# Altium project Assignment_2.PrjPcb
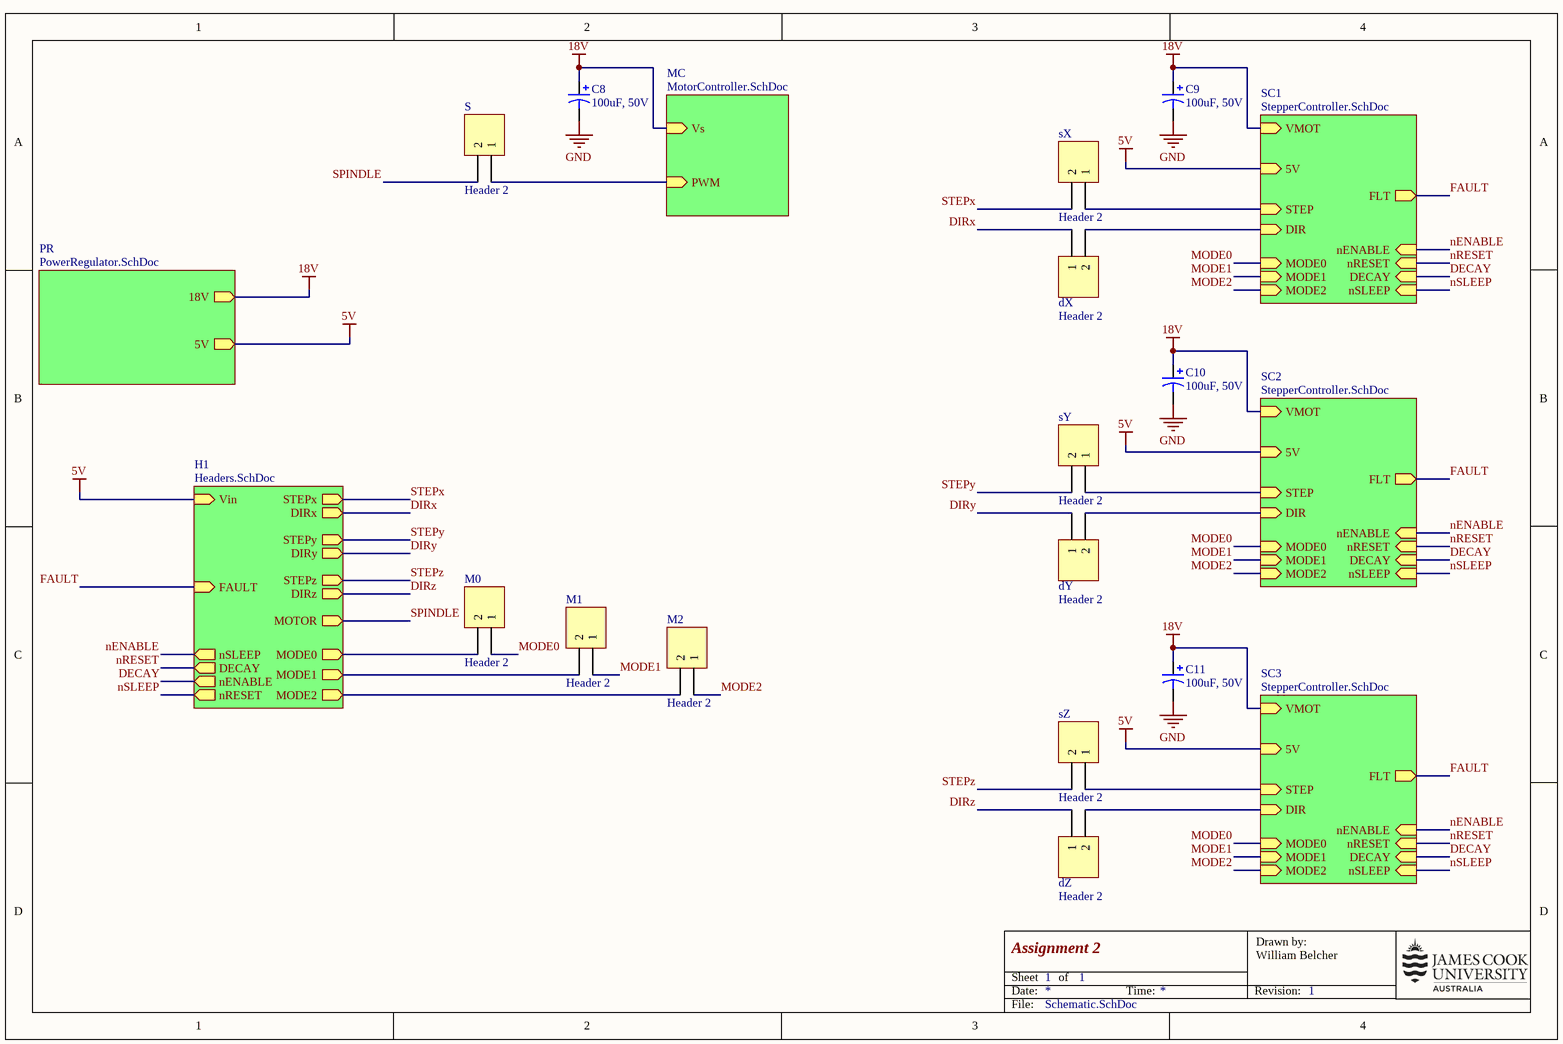
[diagram p0: Schematic.SchDoc]
5 sheets, 66 parts. Net scope: hierarchical (ports join the sheet entries above them; power ports are global).
Board file: PCB.PcbDoc
Sheets:
  Schematic.SchDoc
    PR = PowerRegulator.SchDoc
    SC1 = StepperController.SchDoc
    H1 = Headers.SchDoc
    MC = MotorController.SchDoc
    SC2 = StepperController.SchDoc
    SC3 = StepperController.SchDoc

## Sheet Schematic.SchDoc: Assignment 2
size A4; DrawnBy: William Belcher; Revision: 1; SheetNumber: 1; SheetTotal: 1

### Parts
C8  100uF, 50V  [Capacitor radial 8mm]
C9  100uF, 50V  [Capacitor radial 8mm]
C10  100uF, 50V  [Capacitor radial 8mm]
C11  100uF, 50V  [Capacitor radial 8mm]
dX  Header 2  [HDR1X2]
dY  Header 2  [HDR1X2]
dZ  Header 2  [HDR1X2]
M0  Header 2  [HDR1X2]
M1  Header 2  [HDR1X2]
M2  Header 2  [HDR1X2]
S  Header 2  [HDR1X2]
sX  Header 2  [HDR1X2]
sY  Header 2  [HDR1X2]
sZ  Header 2  [HDR1X2]

### Sub-sheets
H1 = Headers.SchDoc: STEPx (out), DIRx (out), DIRy (out), STEPy (out), STEPz (out), DIRz (out), MOTOR (out), MODE1 (out), MODE2 (out), MODE0 (out), FAULT (in), Vin (in), nSLEEP (out), DECAY (out), nENABLE (out), nRESET (out)
MC = MotorController.SchDoc: PWM (in), Vs (in)
PR = PowerRegulator.SchDoc: 18V (out), 5V (out)
SC1 = StepperController.SchDoc: DIR (in), STEP (in), VMOT (in), 5V (in), FLT (out), MODE0 (in), MODE1 (in), MODE2 (in), nENABLE (in), nRESET (in), DECAY (in), nSLEEP (in)
SC2 = StepperController.SchDoc: DIR (in), STEP (in), VMOT (in), 5V (in), FLT (out), MODE0 (in), MODE1 (in), MODE2 (in), nENABLE (in), nRESET (in), DECAY (in), nSLEEP (in)
SC3 = StepperController.SchDoc: DIR (in), STEP (in), VMOT (in), 5V (in), FLT (out), MODE0 (in), MODE1 (in), MODE2 (in), nENABLE (in), nRESET (in), DECAY (in), nSLEEP (in)

### Nets
5V: sheet PR/5V, sheet SC1/5V, sheet H1/Vin, sheet SC2/5V, sheet SC3/5V
18V: C8.1 C9.1 C10.1 C11.1 ; sheet PR/18V, sheet SC1/VMOT, sheet MC/Vs, sheet SC2/VMOT, sheet SC3/VMOT
GND: C8.2 C9.2 C10.2 C11.2
DECAY: sheet SC1/DECAY, sheet H1/nENABLE, sheet SC2/DECAY, sheet SC3/DECAY
DIRx: dX.1 ; sheet H1/DIRx
DIRy: dY.1 ; sheet H1/DIRy
DIRz: dZ.1 ; sheet H1/DIRz
FAULT: sheet SC1/FLT, sheet H1/FAULT, sheet SC2/FLT, sheet SC3/FLT
MODE0: M0.1 ; sheet SC1/MODE0, sheet SC2/MODE0, sheet SC3/MODE0
MODE1: M1.1 ; sheet SC1/MODE1, sheet SC2/MODE1, sheet SC3/MODE1
MODE2: M2.1 ; sheet SC1/MODE2, sheet SC2/MODE2, sheet SC3/MODE2
nENABLE: sheet SC1/nENABLE, sheet H1/nSLEEP, sheet SC2/nENABLE, sheet SC3/nENABLE
nRESET: sheet SC1/nRESET, sheet H1/DECAY, sheet SC2/nRESET, sheet SC3/nRESET
nSLEEP: sheet SC1/nSLEEP, sheet H1/nRESET, sheet SC2/nSLEEP, sheet SC3/nSLEEP
SPINDLE: S.2 ; sheet H1/MOTOR
STEPx: sX.2 ; sheet H1/STEPx
STEPy: sY.2 ; sheet H1/STEPy
STEPz: sZ.2 ; sheet H1/STEPz
Net*_J1_7: M2.2 ; sheet H1/MODE2
Net*_J1_9: M1.2 ; sheet H1/MODE1
Net*_J1_11: M0.2 ; sheet H1/MODE0
NetdX_2: dX.2 ; sheet SC1/DIR
NetdY_2: dY.2 ; sheet SC2/DIR
NetdZ_2: dZ.2 ; sheet SC3/DIR
NetQ1x_22: sX.1 ; sheet SC1/STEP
NetQ1y_22: sY.1 ; sheet SC2/STEP
NetQ1z_22: sZ.1 ; sheet SC3/STEP
NetR1_1: S.1 ; sheet MC/PWM

### Notes on the sheet
- Date:
- Sheet
- of
- Time:
- Revision:
- Drawn by:
- File:

### Library data of the parts
C8-C11 = Cap 100uF, 50V, THT radial: Electrolytic Capacitor, 100 µF, 50 V, ± 20%, Radial Leaded, 8 mm
dX dY dZ M0-M2 S sX sY sZ = Header 2: Header, 2-Pin; LatestRevisionDate: 17-Jul-2002; LatestRevisionNote: Re-released for DXP Platform.; Publisher: Altium Limited

## Sheet PowerRegulator.SchDoc
size A4
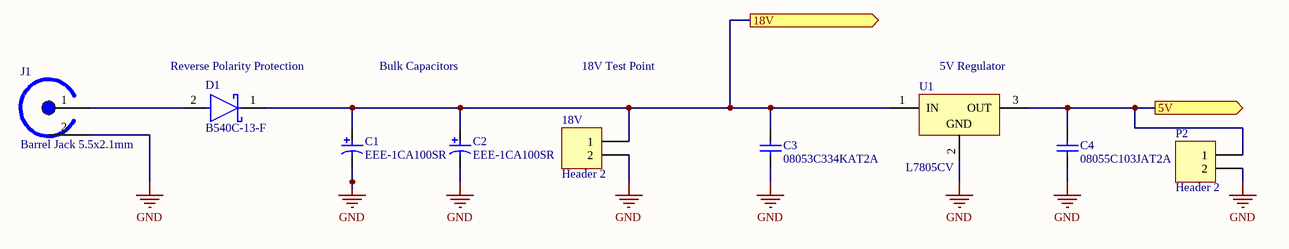
[diagram p1: PowerRegulator.SchDoc]

### Parts
(Parts that share a designator on the sheet are numbered #1, #2 ... from top to bottom, then left to right.)
18V  Header 2  [HDR1X2]
C1#1  EEE-1CA100SR  [PNSC-EEE1CA100SR_L]
C2  EEE-1CA100SR  [PNSC-EEE1CA100SR_L]
C3  08053C334KAT2A  [CAPC2013X140X50NL20T25]
C4  08055C103JAT2A  [CAPC2013X94X50ML20T25]
D1#1  B540C-13-F  [FP-SMC-MFG]
J1  Barrel Jack 5.5x2.1mm  [Barrel Jack 2.1x5.5mm THT]
P2  Header 2  [HDR1X2]
U1  L7805CV  [TO220]

### Ports
5V (out), 18V (out)

### Nets
5V: C4.2 P2.1 U1.3(OUT) ; port 5V
18V: 18V.1 C1#1.1 C2.1 C3.1 D1#1.1(C) U1.1(IN) ; port 18V
GND: 18V.2 C1#1.2 C2.2 C3.2 C4.1 J1.2(SLEEVE) P2.2 U1.2(GND)
NetD1#1_2: D1#1.2(A) J1.1(TIP)

### Notes on the sheet
- (near D1#1) Reverse Polarity Protection
- Bulk Capacitors
- 18V Test Point
- (near U1) 5V Regulator

### Library data of the parts
18V P2 = Header 2: Header, 2-Pin; LatestRevisionDate: 17-Jul-2002; LatestRevisionNote: Re-released for DXP Platform.; Publisher: Altium Limited
C1#1 C2 = CMP-2000-06199-1: Aluminum Electrolytic Capacitor, 10 uF, +/- 20%, -40 to 85 degC, 2-Pin SMD, RoHS, Tape and Reel; Manufacturer: Panasonic; Lead Length: 1.8mm; No. of Pins: 2; Ripple Current Frequency: 120Hz; Ripple Current Temperature: 85°C; External Depth: 4.3mm; Operating Lifetime: 2000h; Power Factor: 0.16; Lead Cross-section Width: 0.65mm; Product Range: PANASONIC-SSeries; Voltage Rating V DC: 16V; Leakage Current: 3µA; Ripple Current AC: 28mA; AE Capacitor Case: RadialCan-SMD; Capacitance: 10µF; Lifetime @ Temperature: 2000hours@85°C; External Length / Height: 5.4mm; SVHC: NoSVHC(16-Dec-2013); Packaging: CutTape; Series: VS; Package Description: 2-Pin Surface Mount Device, Body 4.5 x 4.5 mm; Tolerance -: 20%; Capacitor Terminals: SMD; Lead Spacing: 1mm; Package / Case: B; Capacitance Tolerance: ±20%; Operating life Time: 2000h; Tape Width: 12mm; Power Factor Frequency: 120Hz; Voltage Rating: 16V; Diameter: 4mm; Operating Temperature Max: 85°C; Datasheet URL: https://datasheet.ciiva.com/19458/1355487-19458346.pdf; Capacitor Mounting: SMD; External Width: 4.3mm; Operating Life Temperature: 85°C; Capacitance Tolerance ±: ±20%; Package Reference: EEE1CA100SR; AC Ripple Current: 28mA; Tolerance +: 20%; Height: 5.4mm; Datasheet Version: 04/2005; Operating Temperature Min: -40°C; Capacitor Case Style: RadialCan-SMD; Mounting Technology: SurfaceMount; Operating Temperature Range: -40°Cto+85°C; Manufacturer URL: http://www.panasonic.com/; Life Time @ Temperature: 2000hours@85°C
C3 = CMP-2007-04608-1: Manufacturer: AVX Interconnect / Elco; Part Number: 08053C334KAT2A
C4 = CMP-2007-04361-1: Manufacturer: AVX Interconnect / Elco; Part Number: 08055C103JAT2A
D1#1 = CMP-12790-000056-1: DIODE SCHOTTKY 40V 5A SMC; Manufacturer: Diodes Inc.; Automotive Grade: NA; Peak Reverse Current: 0.5mA; Value: 300pF; Max Junction Temp: +150°C; Max Surge Forward Current: 100A; Standoff Height: 0.1mm; Digikey Description: DIODE SCHOTTKY 40V 5A SMC; Temperature Range Low: -55°C; Manufacturer Part Number: B540C-13-F; Octopart: https://octopart.com/b540c-13-f-diodes+inc.-325873; Lead Free: Yes; Reverse Voltage: 40V; RoHS: TRUE; Category: Diode; Mouser Description: Diode: Schottky rectifying; SMD; 40V; 5A; SMC; Package: reel, tape; ComponentLink2Description: Datasheet; Temperature Range High: +150°C; Automotive: No; Footprint Url: https://www.diodes.com/assets/Package-Files/SMC.pdf; Device Class L3: Schottky Diodes; Height: 2.5mm; Forward Current: 5A; Temperature: -55°C to +150°C; Package: SMC; ComponentLink2URL: https://www.diodes.com/assets/Datasheets/ds13012.pdf; Device Class L2: Diodes; Max Repetitive Reverse Voltage: 40V; Device Class L1: Discrete Semiconductors; Capacitance: 300pF
J1 = Barrel Jack 5.5x2.1mm: GCT DCJ200-10-A-K1-K
U1 = CMP-0244-00483-1: Positive Voltage Regulator, 5V, 3-Pin TO-220; PackageDescription: TO, Thru-Hole, Vertical, Heatsink Mounted; 3 In-Line Leads; Pitch 2.54 mm; ComponentLink2Description: Datasheet; PackageReference: TO220; ComponentLink3URL: http://www.st.com/internet/com/TECHNICAL_RESOURCES/TECHNICAL_LITERATURE/PACKAGE_INFORMATION/CD00004649.pdf; DatasheetVersion: 16/11/2011; ComponentLink1Description: Manufacturer URL; ComponentLink1URL: http://www.st.com; PackageVersion: ver3.0; ComponentLink3Description: Package Specification; ComponentLink2URL: http://www.st.com/internet/com/TECHNICAL_RESOURCES/TECHNICAL_LITERATURE/DATASHEET/CD00000444.pdf

## Sheet StepperController.SchDoc
size A4
Used 3 times, as channels SC1, SC2, SC3. Parts and nets are listed once, with the designators drawn on the sheet.
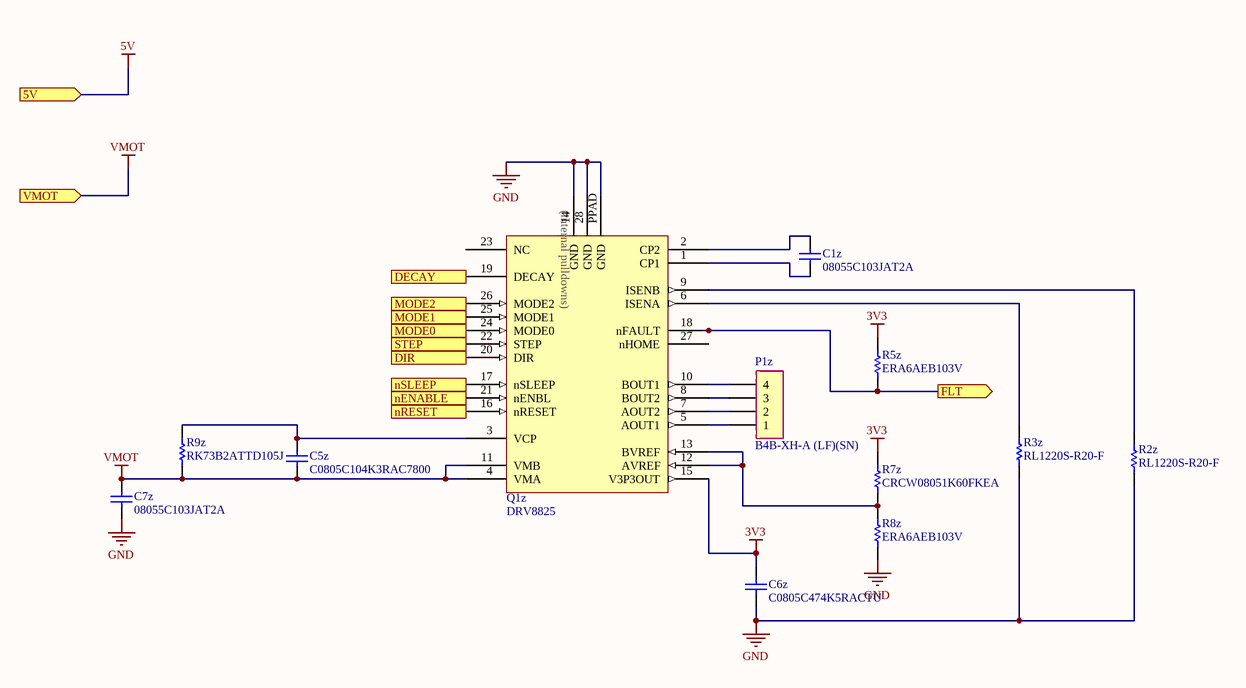
[diagram p2: StepperController.SchDoc]

### Parts
C1z  08055C103JAT2A  [CAPC2013X94X50ML20T25]
C5z  C0805C104K3RAC7800  [CAPC2013X145X50ML20T25]
C6z  C0805C474K5RACTU  [CAPC2013X110X50NL20T25]
C7z  08055C103JAT2A  [CAPC2013X94X50ML20T25]
P1z  B4B-XH-A (LF)(SN)  [B4B-XH-A (LF)(SN)]
Q1z  DRV8825  [DRV8825 HTSSOP]
R2z  RL1220S-R20-F  [RESC2013X50X40ML20T20]
R3z  RL1220S-R20-F  [RESC2013X50X40ML20T20]
R5z  ERA6AEB103V  [RESC2013X60X40ML20T25]
R7z  CRCW08051K60FKEA  [RESC2013X50X30NL20T20]
R8z  ERA6AEB103V  [RESC2013X60X40ML20T25]
R9z  RK73B2ATTD105J  [RESC2013X60X30NL20T20]

### Ports
5V (in), DECAY (in), DIR (in), FLT (out), MODE0 (in), MODE1 (in), MODE2 (in), nENABLE (in), nRESET (in), nSLEEP (in), STEP (in), VMOT (in)

### Nets
3V3: C6z.2 Q1z.15(V3P3OUT) R5z.1 R7z.2
GND: C6z.1 C7z.1 Q1z.14(GND) Q1z.28(GND) Q1z.PPAD(GND) R2z.1 R3z.1 R8z.1
VMOT: C5z.2 C7z.2 Q1z.4(VMA) Q1z.11(VMB) R9z.1 ; port VMOT
DECAY: Q1z.19(DECAY) ; port DECAY
DIR: Q1z.20(DIR) ; port DIR
FLT: Q1z.18(nFAULT) R5z.2 ; port FLT
MODE0: Q1z.24(MODE0) ; port MODE0
MODE1: Q1z.25(MODE1) ; port MODE1
MODE2: Q1z.26(MODE2) ; port MODE2
nENABLE: Q1z.21(nENBL) ; port nENABLE
nRESET: Q1z.16(nRESET) ; port nRESET
nSLEEP: Q1z.17(nSLEEP) ; port nSLEEP
STEP: Q1z.22(STEP) ; port STEP
NetC1z_1: C1z.1 Q1z.1(CP1)
NetC1z_2: C1z.2 Q1z.2(CP2)
NetC5z_1: C5z.1 Q1z.3(VCP) R9z.2
NetP1z_1: P1z.1 Q1z.5(AOUT1)
NetP1z_2: P1z.2 Q1z.7(AOUT2)
NetP1z_3: P1z.3 Q1z.8(BOUT2)
NetP1z_4: P1z.4 Q1z.10(BOUT1)
NetQ1z_6: Q1z.6(ISENA) R3z.2
NetQ1z_9: Q1z.9(ISENB) R2z.2
NetQ1z_12: Q1z.12(AVREF) Q1z.13(BVREF) R7z.1 R8z.2

Not connected (* = marked no-connect by the designer): Q1z 23(NC) 27(nHOME)

### Channels
SC1: designators C1z=C1x C5z=C5x C6z=C6x C7z=C7x P1z=P1x Q1z=Q1x R2z=R2x R3z=R3x R5z=R5x R7z=R7x R8z=R8x R9z=R9x; ports 5V=5V DECAY=DECAY DIR=NetdX_2 FLT=FAULT MODE0=MODE0 MODE1=MODE1 MODE2=MODE2 nENABLE=nENABLE nRESET=nRESET nSLEEP=nSLEEP STEP=NetQ1x_22 VMOT=18V
SC2: designators C1z=C1y C5z=C5y C6z=C6y C7z=C7y P1z=P1y Q1z=Q1y R2z=R2y R3z=R3y R5z=R5y R7z=R7y R8z=R8y R9z=R9y; ports 5V=5V DECAY=DECAY DIR=NetdY_2 FLT=FAULT MODE0=MODE0 MODE1=MODE1 MODE2=MODE2 nENABLE=nENABLE nRESET=nRESET nSLEEP=nSLEEP STEP=NetQ1y_22 VMOT=18V
SC3: ports 5V=5V DECAY=DECAY DIR=NetdZ_2 FLT=FAULT MODE0=MODE0 MODE1=MODE1 MODE2=MODE2 nENABLE=nENABLE nRESET=nRESET nSLEEP=nSLEEP STEP=NetQ1z_22 VMOT=18V

### Notes on the sheet
- Date:
- Sheet
- of
- Time:
- Revision:
- Drawn by:
- File:
- (in symbol Stepper motor driver DRV8825) (internal pulldowns)

### Library data of the parts
C1z C7z = CMP-2007-04361-1: Manufacturer: AVX Interconnect / Elco; Part Number: 08055C103JAT2A
C5z = CMP-2007-01100-1: Manufacturer: Kemet; Part Number: C0805C104K3RAC7800
C6z = CMP-2007-03659-1: Manufacturer: Kemet; Part Number: C0805C474K5RACTU
P1z = B4B-XH-A (LF)(SN) Wire-to-board connector: Wire-to-board connector, vertical, 2.5mm, 4 contacts
Q1z = Stepper motor driver DRV8825: TI DRV8825 Stepper Motor Controller IC
R2z R3z = CMP-2001-03157-1: Manufacturer: Susumu; Part Number: RL1220S-R20-F
R5z R8z = CMP-2001-00582-1: Manufacturer: Panasonic; Part Number: ERA6AEB103V
R7z = CMP-2001-03618-1: Manufacturer: Vishay Dale; Part Number: CRCW08051K60FKEA
R9z = CMP-2001-04658-1: Manufacturer: KOA Speer; Part Number: RK73B2ATTD105J

## Sheet Headers.SchDoc
size A4
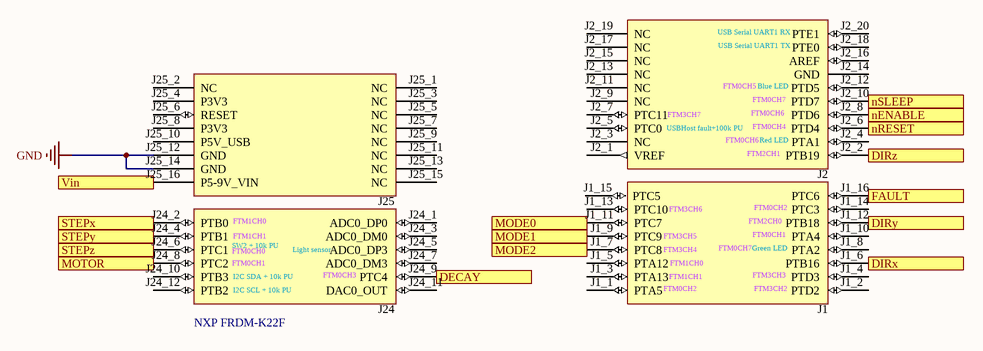
[diagram p3: Headers.SchDoc]

### Parts
*  NXP FRDM-K22F  [FRDM-K22F]

### Ports
DECAY (out), DIRx (out), DIRy (out), DIRz (out), FAULT (in), MODE0 (out), MODE1 (out), MODE2 (out), MOTOR (out), nENABLE (out), nRESET (out), nSLEEP (out), STEPx (out), STEPy (out), STEPz (out), Vin (in)

### Nets
5V: *.J25_16(P5-9V_VIN) ; port Vin
GND: *.J25_12(GND) *.J25_14(GND)
DECAY: *.J2_8(PTD6) ; port nENABLE
DIRx: *.J1_6(PTB16) ; port DIRx
DIRy: *.J1_12(PTB18) ; port DIRy
DIRz: *.J2_2(PTB19) ; port DIRz
FAULT: *.J1_16(PTC6) ; port FAULT
nENABLE: *.J2_10(PTD7) ; port nSLEEP
nRESET: *.J24_9(PTC4) ; port DECAY
nSLEEP: *.J2_6(PTD4) ; port nRESET
SPINDLE: *.J24_8(PTC2) ; port MOTOR
STEPx: *.J24_2(PTB0) ; port STEPx
STEPy: *.J24_4(PTB1) ; port STEPy
STEPz: *.J24_6(PTC1) ; port STEPz
Net*_J1_7: *.J1_7(PTC8) ; port MODE2
Net*_J1_9: *.J1_9(PTC9) ; port MODE1
Net*_J1_11: *.J1_11(PTC7) ; port MODE0

Not connected (* = marked no-connect by the designer): * J1_1(PTA5) J1_2(PTD2) J1_3(PTA13) J1_4(PTD3) J1_5(PTA12) J1_8(PTA2) J1_10(PTA4) J1_13(PTC10) J1_14(PTC3) J1_15(PTC5) J2_1(VREF) J2_3(NC) J2_4(PTA1) J2_5(PTC0) J2_7(PTC11) J2_9(NC) J2_11(NC) J2_12(PTD5) J2_13(NC) J2_14(GND) J2_15(NC) J2_16(AREF) J2_17(NC) J2_18(PTE0) J2_19(NC) J2_20(PTE1) J24_1(ADC0_DP0) J24_3(ADC0_DM0) J24_5(ADC0_DP3) J24_7(ADC0_DM3) J24_10(PTB3) J24_11(DAC0_OUT) J24_12(PTB2) J25_1(NC) J25_2(NC) J25_3(NC) J25_4(P3V3) J25_5(NC) J25_6(RESET) J25_7(NC) J25_8(P3V3) J25_9(NC) J25_10(P5V_USB) J25_11(NC) J25_13(NC) J25_15(NC)

### Notes on the sheet
- Date:
- Sheet
- of
- Time:
- Revision:
- Drawn by:
- File:
- (in symbol NXP FRDM-K22F) USB Serial UART1 RX; USB Serial UART1 TX; FTM0CH5; Blue LED; FTM0CH7; FTM3CH7; FTM0CH6; USBHost fault+100k PU; FTM0CH4; Red LED; FTM2CH1; J2; J25; FTM3CH6; FTM0CH2; FTM1CH0; FTM2CH0; FTM1CH1; FTM3CH5; FTM0CH1; SW2 + 10k PU; FTM0CH0; Light sensor; FTM3CH4; Green LED; I2C SDA + 10k PU; FTM0CH3; FTM3CH3; I2C SCL + 10k PU; FTM3CH2; J24; J1

## Sheet MotorController.SchDoc
size A4
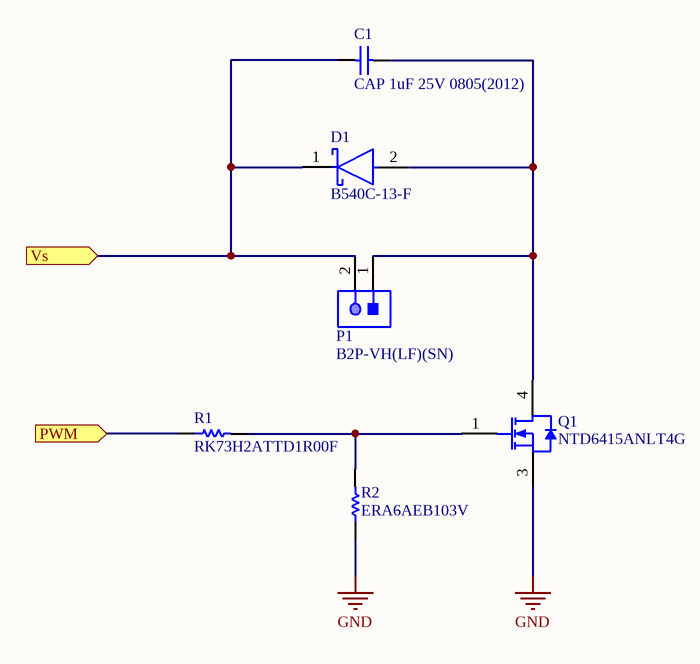
[diagram p4: MotorController.SchDoc]

### Parts
(Parts that share a designator on the sheet are numbered #1, #2 ... from top to bottom, then left to right.)
C1#2  CAP 1uF 25V 0805(2012)  [CAPC0805(2012)145_L]
D1#2  B540C-13-F  [FP-SMC-MFG]
P1  B2P-VH(LF)(SN)  [JST-B2P-VH(LF)(SN)_V]
Q1  NTD6415ANLT4G  [ONSC-DPAK-3-369AA-01_V]
R1  RK73H2ATTD1R00F  [RESC2013X60X30NL20T20]
R2  ERA6AEB103V  [RESC2013X60X40ML20T25]

### Ports
PWM (in), Vs (in)

### Nets
18V: C1#2.1 D1#2.1(C) P1.2 ; port Vs
GND: Q1.3(S) R2.1
NetC1#2_2: C1#2.2 D1#2.2(A) P1.1 Q1.4(D)
NetQ1_1: Q1.1(G) R1.2 R2.2
NetR1_1: R1.1 ; port PWM

### Notes on the sheet
- Date:
- Sheet
- of
- Time:
- Revision:
- Drawn by:
- File:

### Library data of the parts
C1#2 = CMP-1036-04757-1: CAP 1uF 25V -20% to +80% 0805 (2012 Metric) Thickness 1.45mm SMD; Case-Metric: 2012; Case-EIA: 0805; Max Thickness: 1.45 mm; Tolerance: -20% to +80%; Rated Voltage: 25 V; Technology: SMT; Value: 1uF
D1#2 = CMP-12790-000056-1: DIODE SCHOTTKY 40V 5A SMC; Manufacturer: Diodes Inc.; Description: Diode Schottky 40V 5A Surface Mount SMC; Automotive Grade: NA; Peak Reverse Current: 0.5mA; Value: 300pF; Max Junction Temp: +150°C; Max Surge Forward Current: 100A; Standoff Height: 0.1mm; Digikey Description: DIODE SCHOTTKY 40V 5A SMC; Temperature Range Low: -55°C; Manufacturer Part Number: B540C-13-F; Octopart: https://octopart.com/b540c-13-f-diodes+inc.-325873; Lead Free: Yes; Reverse Voltage: 40V; RoHS: TRUE; Category: Diode; Mouser Description: Diode: Schottky rectifying; SMD; 40V; 5A; SMC; Package: reel, tape; ComponentLink2Description: Datasheet; Temperature Range High: +150°C; Automotive: No; Footprint Url: https://www.diodes.com/assets/Package-Files/SMC.pdf; Device Class L3: Schottky Diodes; Height: 2.5mm; Forward Current: 5A; Temperature: -55°C to +150°C; Package: SMC; ComponentLink2URL: https://www.diodes.com/assets/Datasheets/ds13012.pdf; Device Class L2: Diodes; Max Repetitive Reverse Voltage: 40V; Device Class L1: Discrete Semiconductors; Capacitance: 300pF
P1 = CMP-1755-00002-1: Male Header, Pitch 3.96 mm, 1 x 2 Position, Height 10.9 mm, Tail Length 3.7 mm, -25 to 85 degC, RoHS, Bulk; Capacitance: 27 pF; Type (Capacitors): C0G; Voltage Rating (DC): 50 V; Resistance: 100000000000 Ohm; Tolerance: 5%; ComponentLink2Description: Datasheet; Height: 0.8 mm; Radiation Hardening: No; Pins: 2; Package Quantity: 4000; Max Operating Temperature: 125degC; Width: 0.8 mm; PackageDescription: Male Header, Pitch 3.96 mm, 1 x 2 Position, Height 10.9 mm, Tail Length 3.7 mm; Case/Package: 0603; PackageReference: B2P-VH(LF)(SN); Voltage Rating: 50 V; REACH SVHC: No SVHC; Mount: Surface Mount; Min Operating Temperature: -55degC; Case Code (Metric): 1608; ComponentLink2URL: http://www.jst-mfg.com/product/pdf/eng/eVH.pdf; DatasheetVersion: May-16; RoHSCompliant: True; ComponentLink1Description: Manufacturer URL; Case Code (Imperial): 0603; Length: 1.6 mm; Packaging: Tape and Reel; ComponentLink1URL: http://www.jst.com/home2.html
Q1 = CMP-1058-00352-1: N-Channel Power MOSFET, 100 V, 23 A, 56 mOhm, 3-Pin DPAK, Pb-Free, Tape and Reel; Manufacturer: On Semiconductor; VGS(th) Max (V): 2; ID Max (A): 23; VGS Max (V): 20; Configuration: Single; Coss Typ (pF): 156; Crss Typ (pF): 70; Qrr Typ (nC): 152; Ciss Typ (pF): 1024; Channel Polarity: N Channel; PD Max (W): 83; ComponentLink1URL: http://www.onsemi.com/; Mounting Technology: Surface Mount; ComponentLink2URL: http://www.onsemi.cn/pub_link/Collateral/NTD6415ANL-D.PDF; RoHS: Pb-Free; PackageVersion: Rev. B, 06/2010; Packing: Tape and Reel; PackageReference: DPAK-3-369AA-01; DatasheetVersion: Rev. 1; ComponentLink1Description: Manufacturer URL; Package Type: DPAK-3; PackageDescription: 3-Pin Flange Mount, Body 6.54 x 6.095 mm, Pitch 2.29 mm; ComponentLink3URL: http://www.onsemi.cn/pub_link/Collateral/369AA.PDF; ComponentLink3Description: Package Specification; PartNumber: NTD6415ANLT4G; ComponentLink2Description: Datasheet
R1 = CMP-2001-02169-1: Manufacturer: KOA Speer; Part Number: RK73H2ATTD1R00F
R2 = CMP-2001-00582-1: Manufacturer: Panasonic; Part Number: ERA6AEB103V

## Nets that join several sheets
3V3: SC1 (C6x.2 Q1x.15 R5x.1 R7x.2), SC2 (C6y.2 Q1y.15 R5y.1 R7y.2), SC3 (C6z.2 Q1z.15 R5z.1 R7z.2)
5V: PowerRegulator (C4.2 P2.1 U1.3), Headers (*.J25_16)
18V: Schematic (C8.1 C9.1 C10.1 C11.1), PowerRegulator (6 pins), SC1 (5 pins), MotorController (C1#2.1 D1#2.1 P1.2), SC2 (5 pins), SC3 (5 pins)
GND: Schematic (C8.2 C9.2 C10.2 C11.2), PowerRegulator (8 pins), SC1 (8 pins), Headers (*.J25_12 *.J25_14), MotorController (Q1.3 R2.1), SC2 (8 pins), SC3 (8 pins)
DECAY: SC1 (Q1x.19), Headers (*.J2_8), SC2 (Q1y.19), SC3 (Q1z.19)
DIRx: Schematic (dX.1), Headers (*.J1_6)
DIRy: Schematic (dY.1), Headers (*.J1_12)
DIRz: Schematic (dZ.1), Headers (*.J2_2)
FAULT: SC1 (Q1x.18 R5x.2), Headers (*.J1_16), SC2 (Q1y.18 R5y.2), SC3 (Q1z.18 R5z.2)
MODE0: Schematic (M0.1), SC1 (Q1x.24), SC2 (Q1y.24), SC3 (Q1z.24)
MODE1: Schematic (M1.1), SC1 (Q1x.25), SC2 (Q1y.25), SC3 (Q1z.25)
MODE2: Schematic (M2.1), SC1 (Q1x.26), SC2 (Q1y.26), SC3 (Q1z.26)
nENABLE: SC1 (Q1x.21), Headers (*.J2_10), SC2 (Q1y.21), SC3 (Q1z.21)
Net*_J1_7: Schematic (M2.2), Headers (*.J1_7)
Net*_J1_9: Schematic (M1.2), Headers (*.J1_9)
Net*_J1_11: Schematic (M0.2), Headers (*.J1_11)
NetdX_2: Schematic (dX.2), SC1 (Q1x.20)
NetdY_2: Schematic (dY.2), SC2 (Q1y.20)
NetdZ_2: Schematic (dZ.2), SC3 (Q1z.20)
NetQ1x_22: Schematic (sX.1), SC1 (Q1x.22)
NetQ1y_22: Schematic (sY.1), SC2 (Q1y.22)
NetQ1z_22: Schematic (sZ.1), SC3 (Q1z.22)
NetR1_1: Schematic (S.1), MotorController (R1.1)
nRESET: SC1 (Q1x.16), Headers (*.J24_9), SC2 (Q1y.16), SC3 (Q1z.16)
nSLEEP: SC1 (Q1x.17), Headers (*.J2_6), SC2 (Q1y.17), SC3 (Q1z.17)
SPINDLE: Schematic (S.2), Headers (*.J24_8)
STEPx: Schematic (sX.2), Headers (*.J24_2)
STEPy: Schematic (sY.2), Headers (*.J24_4)
STEPz: Schematic (sZ.2), Headers (*.J24_6)